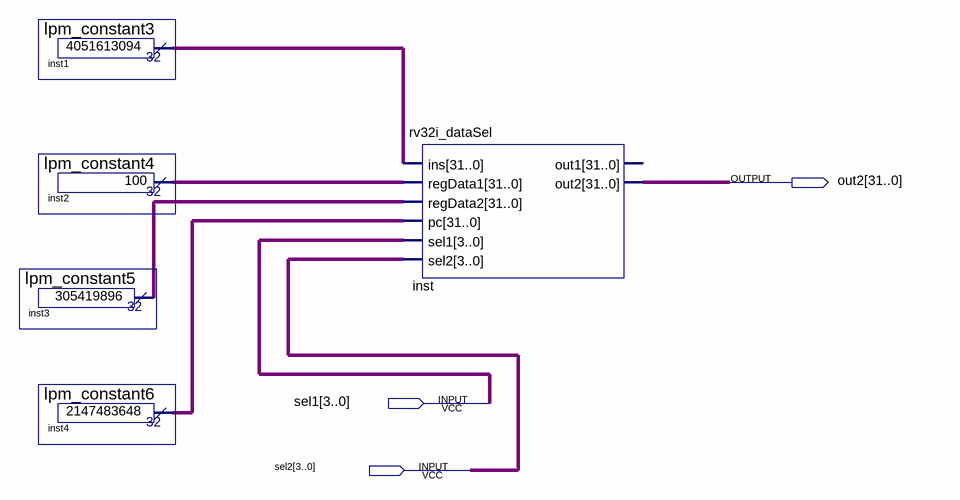
[diagram p0: schematic sheet]
// Quartus schematic rv32i_dataSel_tester.bdf as structural Verilog: 5 symbols, 3 pins
module rv32i_dataSel_tester (
  input  [3:0] sel1,
  input  [3:0] sel2,
  output [31:0] out2
);

  wire [31:0] inst1_result, inst2_result, inst3_result, inst4_result;

  lpm_constant3 inst1 (.result(inst1_result));
  lpm_constant4 inst2 (.result(inst2_result));
  lpm_constant5 inst3 (.result(inst3_result));
  lpm_constant6 inst4 (.result(inst4_result));
  rv32i_dataSel inst (
    .ins(inst1_result), .regData1(inst2_result), .regData2(inst3_result), .pc(inst4_result), .sel1(sel1),
    .sel2(sel2), .out2(out2));  // open: out1
endmodule
